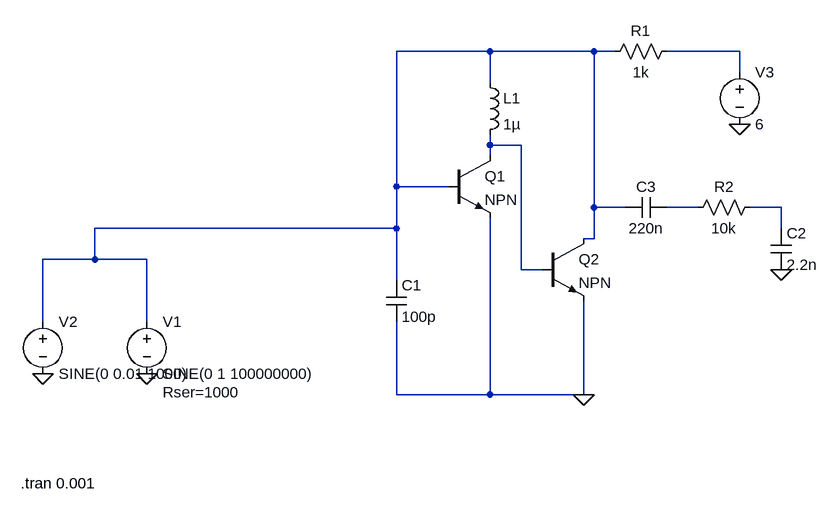
[diagram p0: schematic Draft1.asc]
Draft1.asc, the LTspice schematic file:
Version 4
SHEET 1 984 680
WIRE 32 -288 -112 -288
WIRE 192 -288 32 -288
WIRE 224 -288 192 -288
WIRE 416 -288 304 -288
WIRE 416 -256 416 -288
WIRE 32 -240 32 -288
WIRE 32 -144 32 -160
WIRE 80 -144 32 -144
WIRE 32 -128 32 -144
WIRE -112 -80 -112 -288
WIRE -32 -80 -112 -80
WIRE 192 -48 192 -288
WIRE 240 -48 192 -48
WIRE 352 -48 304 -48
WIRE 480 -48 432 -48
WIRE -112 -16 -112 -80
WIRE -112 -16 -576 -16
WIRE 480 -16 480 -48
WIRE 192 0 192 -48
WIRE 192 0 176 0
WIRE -576 32 -576 -16
WIRE -576 32 -656 32
WIRE -496 32 -576 32
WIRE 80 48 80 -144
WIRE 112 48 80 48
WIRE -112 64 -112 -16
WIRE -656 128 -656 32
WIRE -496 128 -496 32
WIRE -112 240 -112 128
WIRE 32 240 32 -32
WIRE 32 240 -112 240
WIRE 176 240 176 96
WIRE 176 240 32 240
FLAG -496 208 0
FLAG -656 208 0
FLAG 416 -176 0
FLAG 176 240 0
FLAG 480 48 0
SYMBOL voltage -496 112 R0
WINDOW 123 0 0 Left 0
WINDOW 39 24 124 Left 2
SYMATTR InstName V1
SYMATTR Value SINE(0 1 100000000)
SYMATTR SpiceLine Rser=1000
SYMBOL voltage -656 112 R0
WINDOW 123 0 0 Left 0
WINDOW 39 0 0 Left 0
SYMATTR InstName V2
SYMATTR Value SINE(0 0.01 1000)
SYMBOL ind 16 -256 R0
SYMATTR InstName L1
SYMATTR Value 1µ
SYMBOL cap -128 64 R0
SYMATTR InstName C1
SYMATTR Value 100p
SYMBOL npn -32 -128 R0
SYMATTR InstName Q1
SYMBOL npn 112 0 R0
SYMATTR InstName Q2
SYMBOL res 320 -304 R90
WINDOW 0 0 56 VBottom 2
WINDOW 3 32 56 VTop 2
SYMATTR InstName R1
SYMATTR Value 1k
SYMBOL voltage 416 -272 R0
WINDOW 123 0 0 Left 0
WINDOW 39 0 0 Left 0
SYMATTR InstName V3
SYMATTR Value 6
SYMBOL res 448 -64 R90
WINDOW 0 0 56 VBottom 2
WINDOW 3 32 56 VTop 2
SYMATTR InstName R2
SYMATTR Value 10k
SYMBOL cap 464 -16 R0
SYMATTR InstName C2
SYMATTR Value 2.2n
SYMBOL cap 304 -64 R90
WINDOW 0 0 32 VBottom 2
WINDOW 3 32 32 VTop 2
SYMATTR InstName C3
SYMATTR Value 220n
TEXT -690 376 Left 2 !.tran 0.001

The netlist it stands for:
* Draft1.asc
V1 N001 0 SINE(0 1 100000000) Rser=1000
V2 N001 0 SINE(0 0.01 1000)
L1 N001 N003 1µ
C1 N001 0 100p
Q1 N003 N001 0 0 NPN
Q2 N001 N003 0 0 NPN
R1 N002 N001 1k
V3 N002 0 6
R2 N005 N004 10k
C2 N005 0 2.2n
C3 N004 N001 220n
.model NPN NPN
.model PNP PNP
.lib standard.bjt
.tran 0.001
.backanno
.end